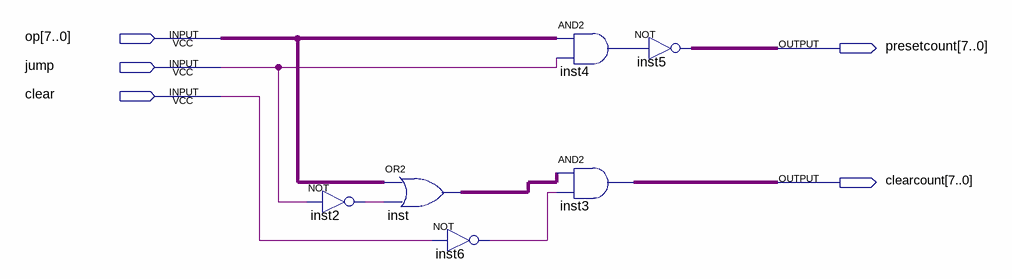
[diagram p0: schematic sheet]
// Quartus schematic jump.bdf as structural Verilog: 6 symbols, 5 pins
module jump (
  input  [7:0] op,
  input  jump,
  input  clear,
  output [7:0] presetcount,
  output [7:0] clearcount
);

  wire inst2_out, inst4_out, inst6_out;
  wire [7:0] inst_out;

  not inst2 (inst2_out, jump);
  assign inst_out = op | {8{inst2_out}};  // OR2 inst, 8 bits wide
  not inst6 (inst6_out, clear);
  assign inst4_out = op & {8{jump}};  // AND2 inst4, 8 bits wide
  assign clearcount = inst_out & {8{inst6_out}};  // AND2 inst3, 8 bits wide
  assign presetcount = ~{8{inst4_out}};  // NOT inst5, 8 bits wide
endmodule
